# Altium schematic sheet FAT35.SchDoc
size A3
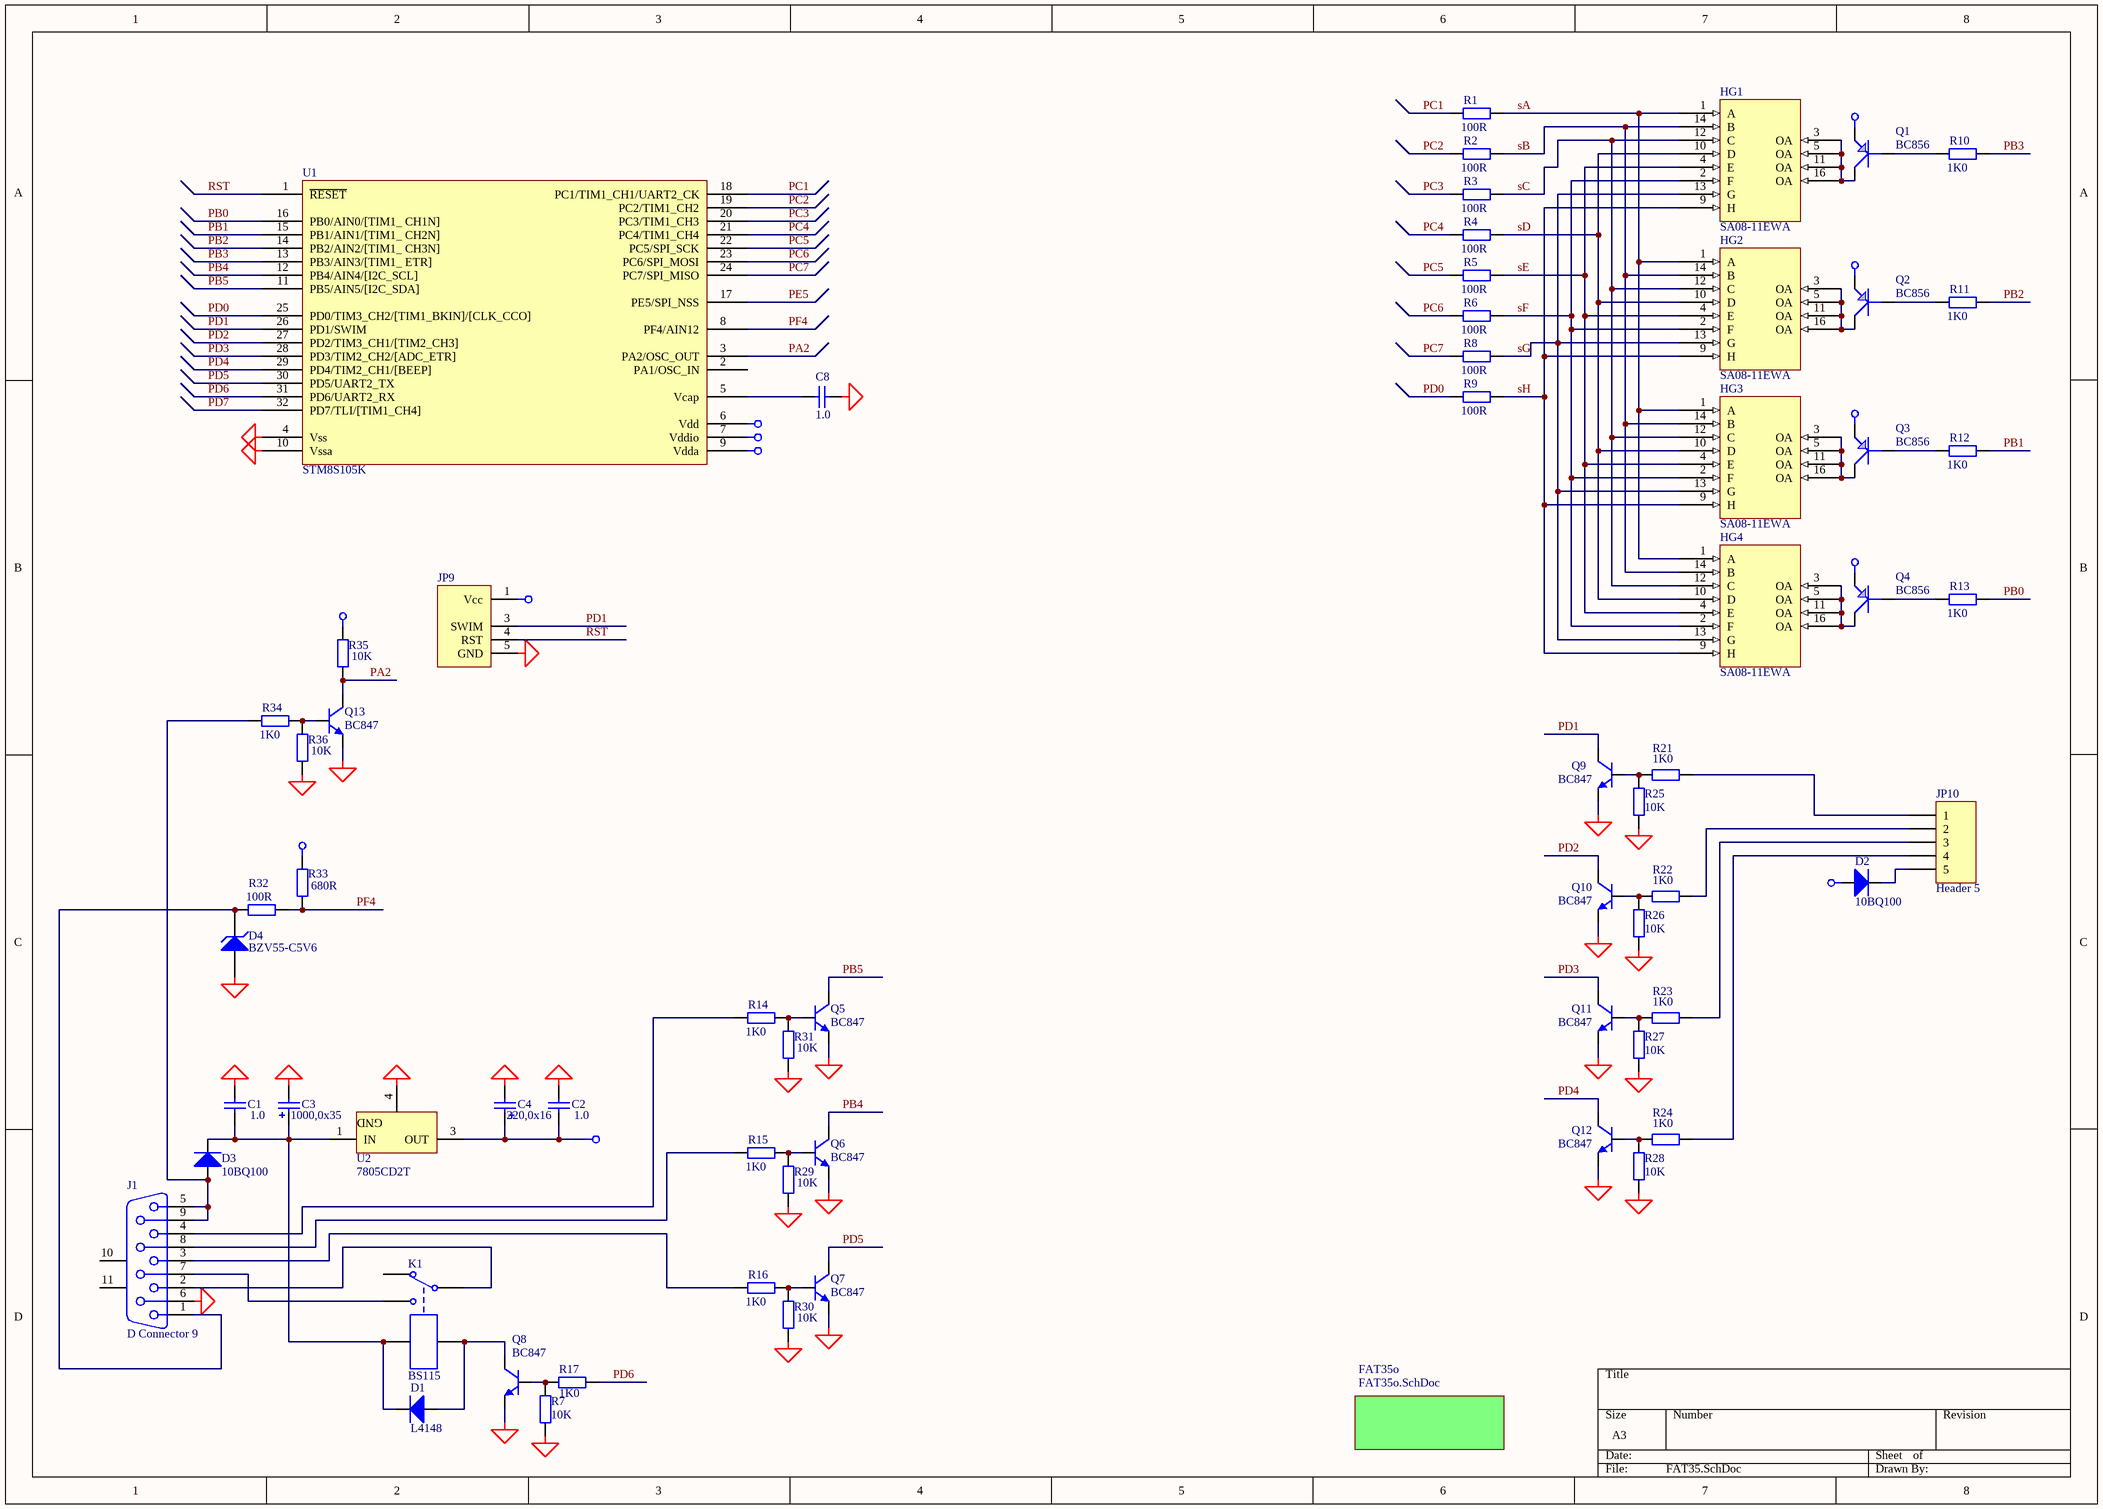
[diagram p0: FAT35.SchDoc]

## Parts
C1  1.0  [_1206]
C2  1.0  [_1206]
C3  1000,0x35  [el3]
C4  220,0x16  [el3]
C8  1.0  [_1206]
D1  L4148  [_1206d]
D2  10BQ100  [D_6_3]
D3  10BQ100  [D_6_3]
D4  BZV55-C5V6  [_1206d]
HG1  SA08-11EWA  [SA08-11]
HG2  SA08-11EWA  [SA08-11]
HG3  SA08-11EWA  [SA08-11]
HG4  SA08-11EWA  [SA08-11]
J1  D Connector 9  [DSUB1.385-2H9]
JP9  (no value)  [HDR1X5_uart]
JP10  Header 5  [HDR1X5]
K1  BS115  [BS115]
Q1  BC856  [SO-G3]
Q2  BC856  [SO-G3]
Q3  BC856  [SO-G3]
Q4  BC856  [SO-G3]
Q5  BC847  [SO-G3]
Q6  BC847  [SO-G3]
Q7  BC847  [SO-G3]
Q8  BC847  [SO-G3]
Q9  BC847  [SO-G3]
Q10  BC847  [SO-G3]
Q11  BC847  [SO-G3]
Q12  BC847  [SO-G3]
Q13  BC847  [SO-G3]
R1  100R  [_1206]
R2  100R  [_1206]
R3  100R  [_1206]
R4  100R  [_1206]
R5  100R  [_1206]
R6  100R  [_1206]
R7  10K  [_1206]
R8  100R  [_1206]
R9  100R  [_1206]
R10  1K0  [_1206]
R11  1K0  [_1206]
R12  1K0  [_1206]
R13  1K0  [_1206]
R14  1K0  [_1206]
R15  1K0  [_1206]
R16  1K0  [_1206]
R17  1K0  [_1206]
R21  1K0  [_1206]
R22  1K0  [_1206]
R23  1K0  [_1206]
R24  1K0  [_1206]
R25  10K  [_1206]
R26  10K  [_1206]
R27  10K  [_1206]
R28  10K  [_1206]
R29  10K  [_1206]
R30  10K  [_1206]
R31  10K  [_1206]
R32  100R  [_1206]
R33  680R  [_1206]
R34  1K0  [_1206]
R35  10K  [_1206]
R36  10K  [_1206]
U1  STM8S105K  [QFP7X7-G32/X.5N]
U2  7805CD2T  [D2PAK]

## Sub-sheets
FAT35o = FAT35o.SchDoc: no entries

## Nets
+5v: C2.2 C4.1 D2.1(A) JP9.1(Vcc) Q1.2(E) Q2.2(E) Q3.2(E) Q4.2(E) R33.1 R35.1 U1.6(Vdd) U1.7(Vddio) U1.9(Vdda) U2.3(OUT)
GND: C1.1 C2.1 C3.2 C4.2 C8.1 D4.1(A) J1.6 JP9.5(GND) Q5.2(E) Q6.2(E) Q7.2(E) Q8.2(E) Q9.2(E) Q10.2(E) Q11.2(E) Q12.2(E) Q13.2(E) R7.2 R25.2 R26.2 R27.2 R28.2 R29.2 R30.2 R31.2 R36.2 U1.4(Vss) U1.10(Vssa) U2.4(GND)
PA2: Q13.3(C) R35.2 U1.3(PA2/OSC_OUT)
PB0: R13.1 U1.16(PB0/AIN0/[TIM1__CH1N])
PB1: R12.1 U1.15(PB1/AIN1/[TIM1__CH2N])
PB2: R11.1 U1.14(PB2/AIN2/[TIM1__CH3N])
PB3: R10.1 U1.13(PB3/AIN3/[TIM1__ETR])
PB4: Q6.3(C) U1.12(PB4/AIN4/[I2C_SCL])
PB5: Q5.3(C) U1.11(PB5/AIN5/[I2C_SDA])
PC1: R1.2 U1.18(PC1/TIM1_CH1/UART2_CK)
PC2: R2.2 U1.19(PC2/TIM1_CH2)
PC3: R3.2 U1.20(PC3/TIM1_CH3)
PC4: R4.2 U1.21(PC4/TIM1_CH4)
PC5: R5.2 U1.22(PC5/SPI_SCK)
PC6: R6.2 U1.23(PC6/SPI_MOSI)
PC7: R8.2 U1.24(PC7/SPI_MISO)
PD0: R9.2 U1.25(PD0/TIM3_CH2/[TIM1_BKIN]/[CLK_CCO])
PD1: JP9.3(SWIM) Q9.3(C) U1.26(PD1/SWIM)
PD2: Q10.3(C) U1.27(PD2/TIM3_CH1/[TIM2_CH3])
PD3: Q11.3(C) U1.28(PD3/TIM2_CH2/[ADC_ETR])
PD4: Q12.3(C) U1.29(PD4/TIM2_CH1/[BEEP])
PD5: Q7.3(C) U1.30(PD5/UART2_TX)
PD6: R17.2 U1.31(PD6/UART2_RX)
PD7: U1.32(PD7/TLI/[TIM1_CH4])
PE5: U1.17(PE5/SPI_NSS)
PF4: R32.1 R33.2 U1.8(PF4/AIN12)
RST: JP9.4(RST) U1.1(~{RESET})
sA: HG1.1(A) HG2.1(A) HG3.1(A) HG4.1(A) R1.1
sB: HG1.14(B) HG2.14(B) HG3.14(B) HG4.14(B) R2.1
sC: HG1.12(C) HG2.12(C) HG3.12(C) HG4.12(C) R3.1
sD: HG1.10(D) HG2.10(D) HG3.10(D) HG4.10(D) R4.1
sE: HG1.4(E) HG2.4(E) HG3.4(E) HG4.4(E) R5.1
sF: HG1.2(F) HG2.2(F) HG3.2(F) HG4.2(F) R6.1
sG: HG1.13(G) HG2.13(G) HG3.13(G) HG4.13(G) R8.1
sH: HG1.9(H) HG2.9(H) HG3.9(H) HG4.9(H) R9.1
NetC1_2: C1.2 C3.1 D1.2(K) D3.2(K) K1.5 U2.1(IN)
NetC8_2: C8.2 U1.5(Vcap)
NetD1_1: D1.1(A) K1.4 Q8.3(C)
NetD2_2: D2.2(K) JP10.5
NetD3_1: D3.1(A) J1.5 J1.9 R34.2
NetD4_2: D4.2(K) J1.1 R32.2
NetHG1_3: HG1.3(OA) HG1.5(OA) HG1.11(OA) HG1.16(OA) Q1.3(C)
NetHG2_3: HG2.3(OA) HG2.5(OA) HG2.11(OA) HG2.16(OA) Q2.3(C)
NetHG3_3: HG3.3(OA) HG3.5(OA) HG3.11(OA) HG3.16(OA) Q3.3(C)
NetHG4_3: HG4.3(OA) HG4.5(OA) HG4.11(OA) HG4.16(OA) Q4.3(C)
NetJ1_2: J1.2 K1.1
NetJ1_3: J1.3 R16.2
NetJ1_4: J1.4 R14.2
NetJ1_7: J1.7 K1.3
NetJ1_8: J1.8 R15.2
NetJP10_1: JP10.1 R21.2
NetJP10_2: JP10.2 R22.2
NetJP10_3: JP10.3 R23.2
NetJP10_4: JP10.4 R24.2
NetQ1_1: Q1.1(B) R10.2
NetQ2_1: Q2.1(B) R11.2
NetQ3_1: Q3.1(B) R12.2
NetQ4_1: Q4.1(B) R13.2
NetQ5_1: Q5.1(B) R14.1 R31.1
NetQ6_1: Q6.1(B) R15.1 R29.1
NetQ7_1: Q7.1(B) R16.1 R30.1
NetQ8_1: Q8.1(B) R7.1 R17.1
NetQ9_1: Q9.1(B) R21.1 R25.1
NetQ10_1: Q10.1(B) R22.1 R26.1
NetQ11_1: Q11.1(B) R23.1 R27.1
NetQ12_1: Q12.1(B) R24.1 R28.1
NetQ13_1: Q13.1(B) R34.1 R36.1

Not connected (* = marked no-connect by the designer): J1 10(MH1) 11(MH2); K1 2; U1 2(PA1/OSC_IN)

## Library data of the parts
C1 C2 C8 = Cap Semi: Capacitor (Semiconductor SIM Model); Manufacturer: Generic Components; Class I: Passive; Value: 0,1; Published: 8-Jun-2000; Revision: July-2002: Re-released for DXP Platform.; Publisher: Altium Limited; Class II: Capacitor
C3 = Cap Pol1: Polarized Capacitor (Radial); Manufacturer: Generic Components; Class I: Passive; Value: 470,0; Published: 8-Jun-2000; Revision: July-2002: Re-released for DXP Platform.; Publisher: Altium Limited; Class II: Capacitor
C4 = Cap Pol1: Polarized Capacitor (Radial); Manufacturer: Generic Components; Class I: Passive; Value: 220,0; Published: 8-Jun-2000; Revision: July-2002: Re-released for DXP Platform.; Publisher: Altium Limited; Class II: Capacitor
D1-D3 = Diode: Default Diode; Manufacturer: Generic Components; Class I: Discrete; Class II: Diode - Switching; Published: 8-Jun-2000; Revision: July-2002: Re-released for DXP Platform.; Publisher: Altium Limited
D4 = D Zener: Zener Diode; Manufacturer: Generic Components; Class I: Discrete; Class II: Diode - Zener; Published: 8-Jun-2000; Revision: July-2002: Re-released for DXP Platform.; Publisher: Altium Limited
HG1-HG4 = SA08-11EWA: Right: 60; Bottom: 90
J1 = D Connector 9: Receptacle Assembly, 9 Position, Right Angle; Manufacturer: Generic Components; Package Information: Latest Revision: O; Positions: 9; Published: 15-Jun-2001; Revision: July-2002: Re-released for DXP Platform.; Datasheet: (1-Sep-1999); Package Reference: 788750; Publisher: Altium Limited; Class I: Connector; Orientation: Right Angle; Gender: Receptacle
JP9 = SWIM_CONN
JP10 = Header 5: Header, 5-Pin; Manufacturer: Generic Components; Class I: Connector; Revision: July-2002: Re-released for DXP Platform.; Publisher: Altium Limited
K1 = BS115: Single-Pole Dual-Throw Relay; Manufacturer: Generic Components; Class I: Electro-mechanical; Published: 24-Mar-1999; Revision: July-2002: Re-released for DXP Platform.; Publisher: Altium Limited; Class II: Relay
Q1-Q4 = GT109: Right: 20; Bottom: 20
Q5-Q13 = BC847ALT1: General Purpose Transistor NPN Silicon; Manufacturer: Motorola; Package Information: Latest Revision: 1997; Class I: Discrete; Class II: BJT - Low Power; Published: 29-Sep-2000; Revision: July-2002: Re-released for DXP Platform.; Datasheet: Latest Revision: 1997; Package Reference: 318-08; Publisher: Altium Limited
R1-R6 R8-R13 = Res2: Resistor; Manufacturer: Generic Components; Class I: Passive; Rule: Undefined; Published: 8-Jun-2000; Revision: July-2002: Re-released for DXP Platform.; Publisher: Altium Limited; Class II: Resistor
  R1-R6 R8 R9: Value: 100R
  R10-R13: Value: 1K0
R7 R25-R31 R35 R36 = Res2: Resistor; Manufacturer: Generic Components; Class I: Passive; Published: 8-Jun-2000; Revision: July-2002: Re-released for DXP Platform.; Publisher: Altium Limited; Class II: Resistor; Value: 10K
R14-R17 R21-R24 R32-R34 = Res2: Resistor; Manufacturer: Generic Components; Class I: Passive; Value: 1K; Published: 8-Jun-2000; Revision: July-2002: Re-released for DXP Platform.; Publisher: Altium Limited; Class II: Resistor
U2 = MC78M05CDT: Three-Terminal Medium Current Positive Voltage Regulator; Manufacturer: ON Semiconductor; Package Information: Latest Revision: 1997; Class I: Power Management; Note: Pin 2 is electrically connected to Pin 4; Pin 2 is trimmed and not drawn;; Published: 15-Apr-2002; Datasheet: Latest Revision: Apr-2000; Package Reference: 369A-13; Publisher: Altium Limited; Class II: Voltage Regulator